# Altium schematic sheet Power.SchDoc
size A4; SheetNumber: 1; SheetTotal: 6
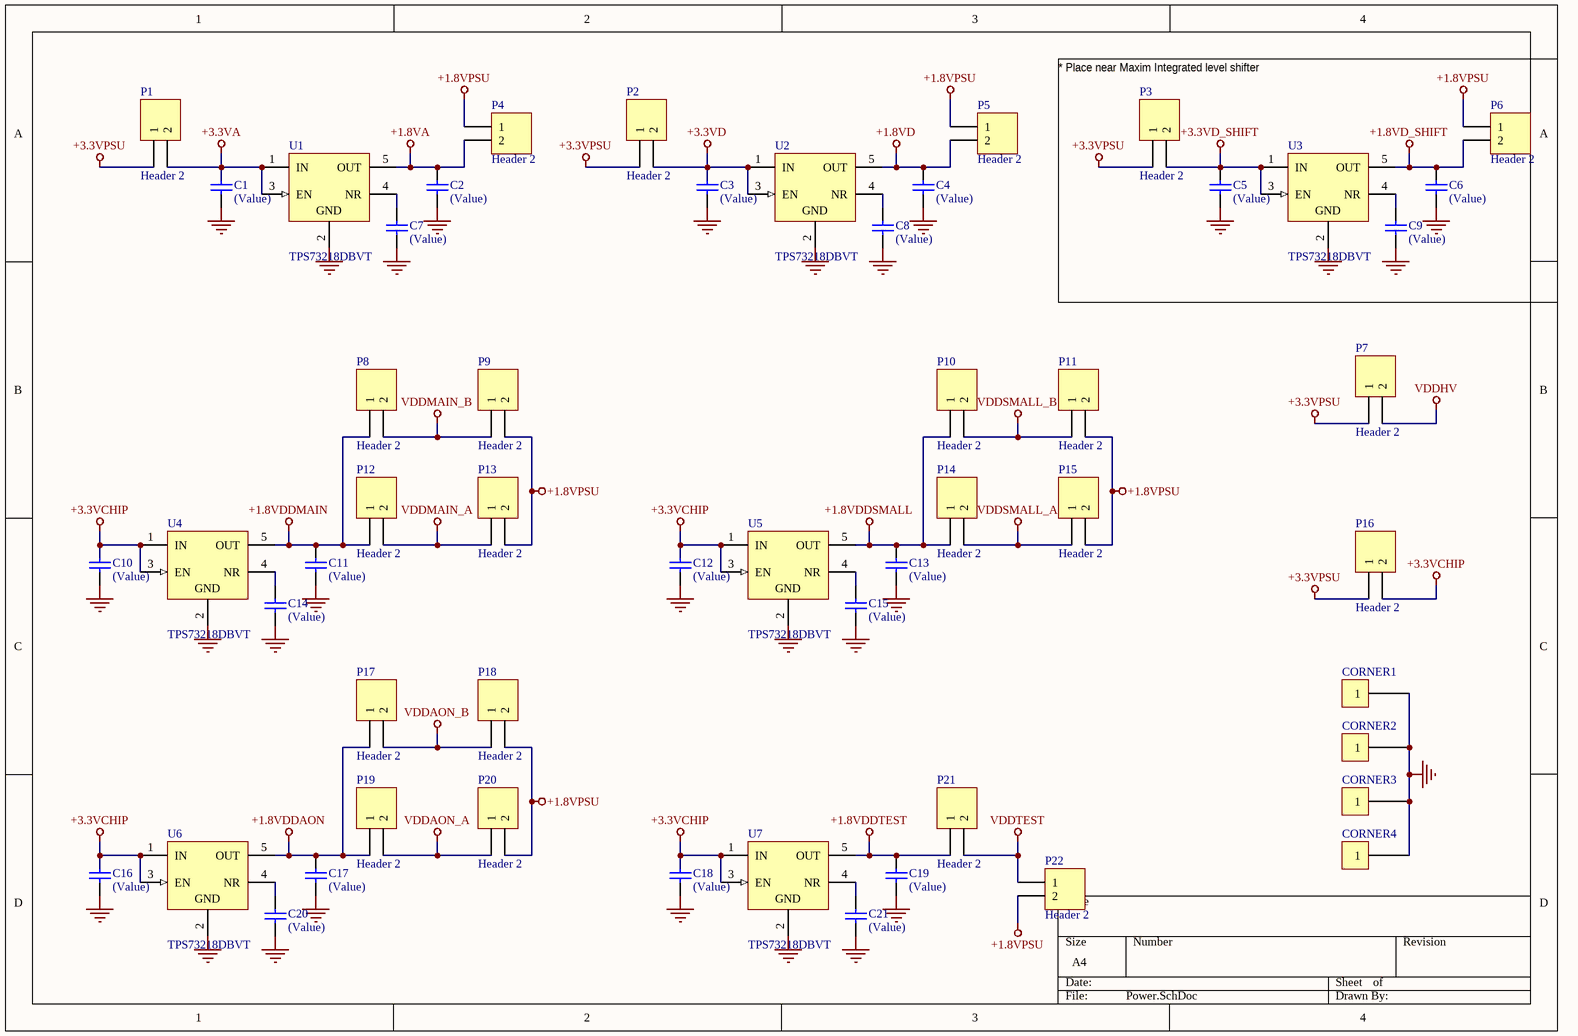
[diagram p0: Power.SchDoc]

## Parts
C1  (Value)  [CAPC1608X90X35ML10T15]
C2  (Value)  [CAPC1608X90X35ML10T15]
C3  (Value)  [CAPC1608X90X35ML10T15]
C4  (Value)  [CAPC1608X90X35ML10T15]
C5  (Value)  [CAPC1608X90X35ML10T15]
C6  (Value)  [CAPC1608X90X35ML10T15]
C7  (Value)  [CAPC1608X90X35ML10T15]
C8  (Value)  [CAPC1608X90X35ML10T15]
C9  (Value)  [CAPC1608X90X35ML10T15]
C10  (Value)  [CAPC1608X90X35ML10T15]
C11  (Value)  [CAPC1608X90X35ML10T15]
C12  (Value)  [CAPC1608X90X35ML10T15]
C13  (Value)  [CAPC1608X90X35ML10T15]
C14  (Value)  [CAPC1608X90X35ML10T15]
C15  (Value)  [CAPC1608X90X35ML10T15]
C16  (Value)  [CAPC1608X90X35ML10T15]
C17  (Value)  [CAPC1608X90X35ML10T15]
C18  (Value)  [CAPC1608X90X35ML10T15]
C19  (Value)  [CAPC1608X90X35ML10T15]
C20  (Value)  [CAPC1608X90X35ML10T15]
C21  (Value)  [CAPC1608X90X35ML10T15]
CORNER1  Corner Mount  [CornerMount]  (value not drawn)
CORNER2  Corner Mount  [CornerMount]  (value not drawn)
CORNER3  Corner Mount  [CornerMount]  (value not drawn)
CORNER4  Corner Mount  [CornerMount]  (value not drawn)
P1  Header 2  [HDR1X2]
P2  Header 2  [HDR1X2]
P3  Header 2  [HDR1X2]
P4  Header 2  [HDR1X2]
P5  Header 2  [HDR1X2]
P6  Header 2  [HDR1X2]
P7  Header 2  [HDR1X2]
P8  Header 2  [HDR1X2]
P9  Header 2  [HDR1X2]
P10  Header 2  [HDR1X2]
P11  Header 2  [HDR1X2]
P12  Header 2  [HDR1X2]
P13  Header 2  [HDR1X2]
P14  Header 2  [HDR1X2]
P15  Header 2  [HDR1X2]
P16  Header 2  [HDR1X2]
P17  Header 2  [HDR1X2]
P18  Header 2  [HDR1X2]
P19  Header 2  [HDR1X2]
P20  Header 2  [HDR1X2]
P21  Header 2  [HDR1X2]
P22  Header 2  [HDR1X2]
U1  TPS73218DBVT  [DBV0005A_N]
U2  TPS73218DBVT  [DBV0005A_N]
U3  TPS73218DBVT  [DBV0005A_N]
U4  TPS73218DBVT  [DBV0005A_N]
U5  TPS73218DBVT  [DBV0005A_N]
U6  TPS73218DBVT  [DBV0005A_N]
U7  TPS73218DBVT  [DBV0005A_N]

## Nets
+1.8VA: C2.1 P4.2 U1.5(OUT)
+1.8VD: C4.1 P5.2 U2.5(OUT)
+1.8VD_SHIFT: C6.1 P6.2 U3.5(OUT)
+1.8VDDAON: C17.1 P17.1 P19.1 U6.5(OUT)
+1.8VDDMAIN: C11.1 P8.1 P12.1 U4.5(OUT)
+1.8VDDSMALL: C13.1 P10.1 P14.1 U5.5(OUT)
+1.8VDDTEST: C19.1 P21.1 U7.5(OUT)
+1.8VPSU: P4.1 P5.1 P6.1 P9.2 P11.2 P13.2 P15.2 P18.2 P20.2 P22.2
+3.3VA: C1.1 P1.2 U1.1(IN) U1.3(EN)
+3.3VCHIP: C10.1 C12.1 C16.1 C18.1 P16.2 U4.1(IN) U4.3(EN) U5.1(IN) U5.3(EN) U6.1(IN) U6.3(EN) U7.1(IN) U7.3(EN)
+3.3VD: C3.1 P2.2 U2.1(IN) U2.3(EN)
+3.3VD_SHIFT: C5.1 P3.2 U3.1(IN) U3.3(EN)
+3.3VPSU: P1.1 P2.1 P3.1 P7.1 P16.1
GND: C1.2 C2.2 C3.2 C4.2 C5.2 C6.2 C7.2 C8.2 C9.2 C10.2 C11.2 C12.2 C13.2 C14.2 C15.2 C16.2 C17.2 C18.2 C19.2 C20.2 C21.2 CORNER1.1 CORNER2.1 CORNER3.1 CORNER4.1 U1.2(GND) U2.2(GND) U3.2(GND) U4.2(GND) U5.2(GND) U6.2(GND) U7.2(GND)
VDDAON_A: P19.2 P20.1
VDDAON_B: P17.2 P18.1
VDDHV: P7.2
VDDMAIN_A: P12.2 P13.1
VDDMAIN_B: P8.2 P9.1
VDDSMALL_A: P14.2 P15.1
VDDSMALL_B: P10.2 P11.1
VDDTEST: P21.2 P22.1
NetC7_1: C7.1 U1.4(NR)
NetC8_1: C8.1 U2.4(NR)
NetC9_1: C9.1 U3.4(NR)
NetC14_1: C14.1 U4.4(NR)
NetC15_1: C15.1 U5.4(NR)
NetC20_1: C20.1 U6.4(NR)
NetC21_1: C21.1 U7.4(NR)

## Notes on the sheet
- * Place near Maxim Integrated level shifter

## Library data of the parts
C1-C21 = CMP-2000-04945-1: 0603; Manufacturer: Murata; Capacitance: 22pF; Tolerance (%): ±5%; Rated Voltage: 50V; Dielectric: C0G; Manufacturer URL: http://www.murata.com/; Datasheet Version: Jul-06; Package Reference: 603; Case Size/Dimension: 0603; Package Description: 2-Pin Surface Mount Device, Body 1.6 x 0.8 mm; Datasheet URL: https://datasheet.ciiva.com/11786/0900766b807a1cab-11786398.pdf
P1-P22 = Header 2: Header, 2-Pin; LatestRevisionDate: 17-Jul-2002; LatestRevisionNote: Re-released for DXP Platform.; Publisher: Altium Limited
U1-U7 = CMP-0394-00378-2: Single Output Fast Transient Response LDO, 200 mA, Fixed 1.8 V Output, 1.7 to 5.5 V Input, with Reverse Current Protection, 5-pin SOT-23 (DBV), -40 to 85 degC, Green (RoHS & no Sb/Br); Manufacturer: Texas Instruments; Iout(Max)(A): 0.25; Iq(Typ)(mA): 0.4; Accuracy(%): 1; Vout Adj(Min)(V): 1.8; Vdo(Typ)(mV): 40; SubFamily: Single Channel LDO; Vin(Min)(V): 1.7; Vin(Max)(V): 5.5; ComponentLink1URL: http://www.ti.com/; PartNumber: TPS73218DBVT; Eco-Plan: Green (RoHS & no Sb/Br); ComponentLink2Description: Datasheet; PackageVersion: 4073253-4/K; ComponentLink3URL: http://www.ti.com/litv/pdf/mpds018i; ComponentLink3Description: Package Specification; ComponentLink1Description: Manufacturer URL; Vout Adj(Max)(V): 1.8; Code_JEDEC: MO-178; ComponentLink2URL: http://www.ti.com/general/docs/lit/getliterature.tsp?genericPartNumber=TPS73218&fileType=pdf; DatasheetVersion: SBVS037O; Mounting Technology: Surface Mount; PackageReference: DBV0005A; PackageDescription: 5-Pin Plastic Small Outline, Body 1.60 Ãƒâ€” 2.90 mm, Pitch 0.95 mm; Fixed Output Options(V): 1.8